# Altium schematic sheet BW1098FFC_MIPI_CAM.SchDoc: =project_title
size Tabloid; PageSetup: Record=PageOptions|CenterHorizontal=True|CenterVertical=True|PrintScale=0.73|XCorrection=1.00|YCorrection=1.00|PrintKind=0|BorderSize=5000000|LeftOffset=0|BottomOffset=0|Orientation=2|PaperLength=1000|PaperWidth=1000|Scale=100|PaperSource=7|PrintQuality=-4|MediaType=1|DitherType=10|PaperKind=A4|PrintScaleMode=1; CompanyName: Luxonis Holding; Organization: Luxonis Holding; Address1: 1925 Harmony Park Drive; Address2: Westminster, CO; Address3: 80234; Address4: United States; SheetNumber: 4; SheetTotal: 5
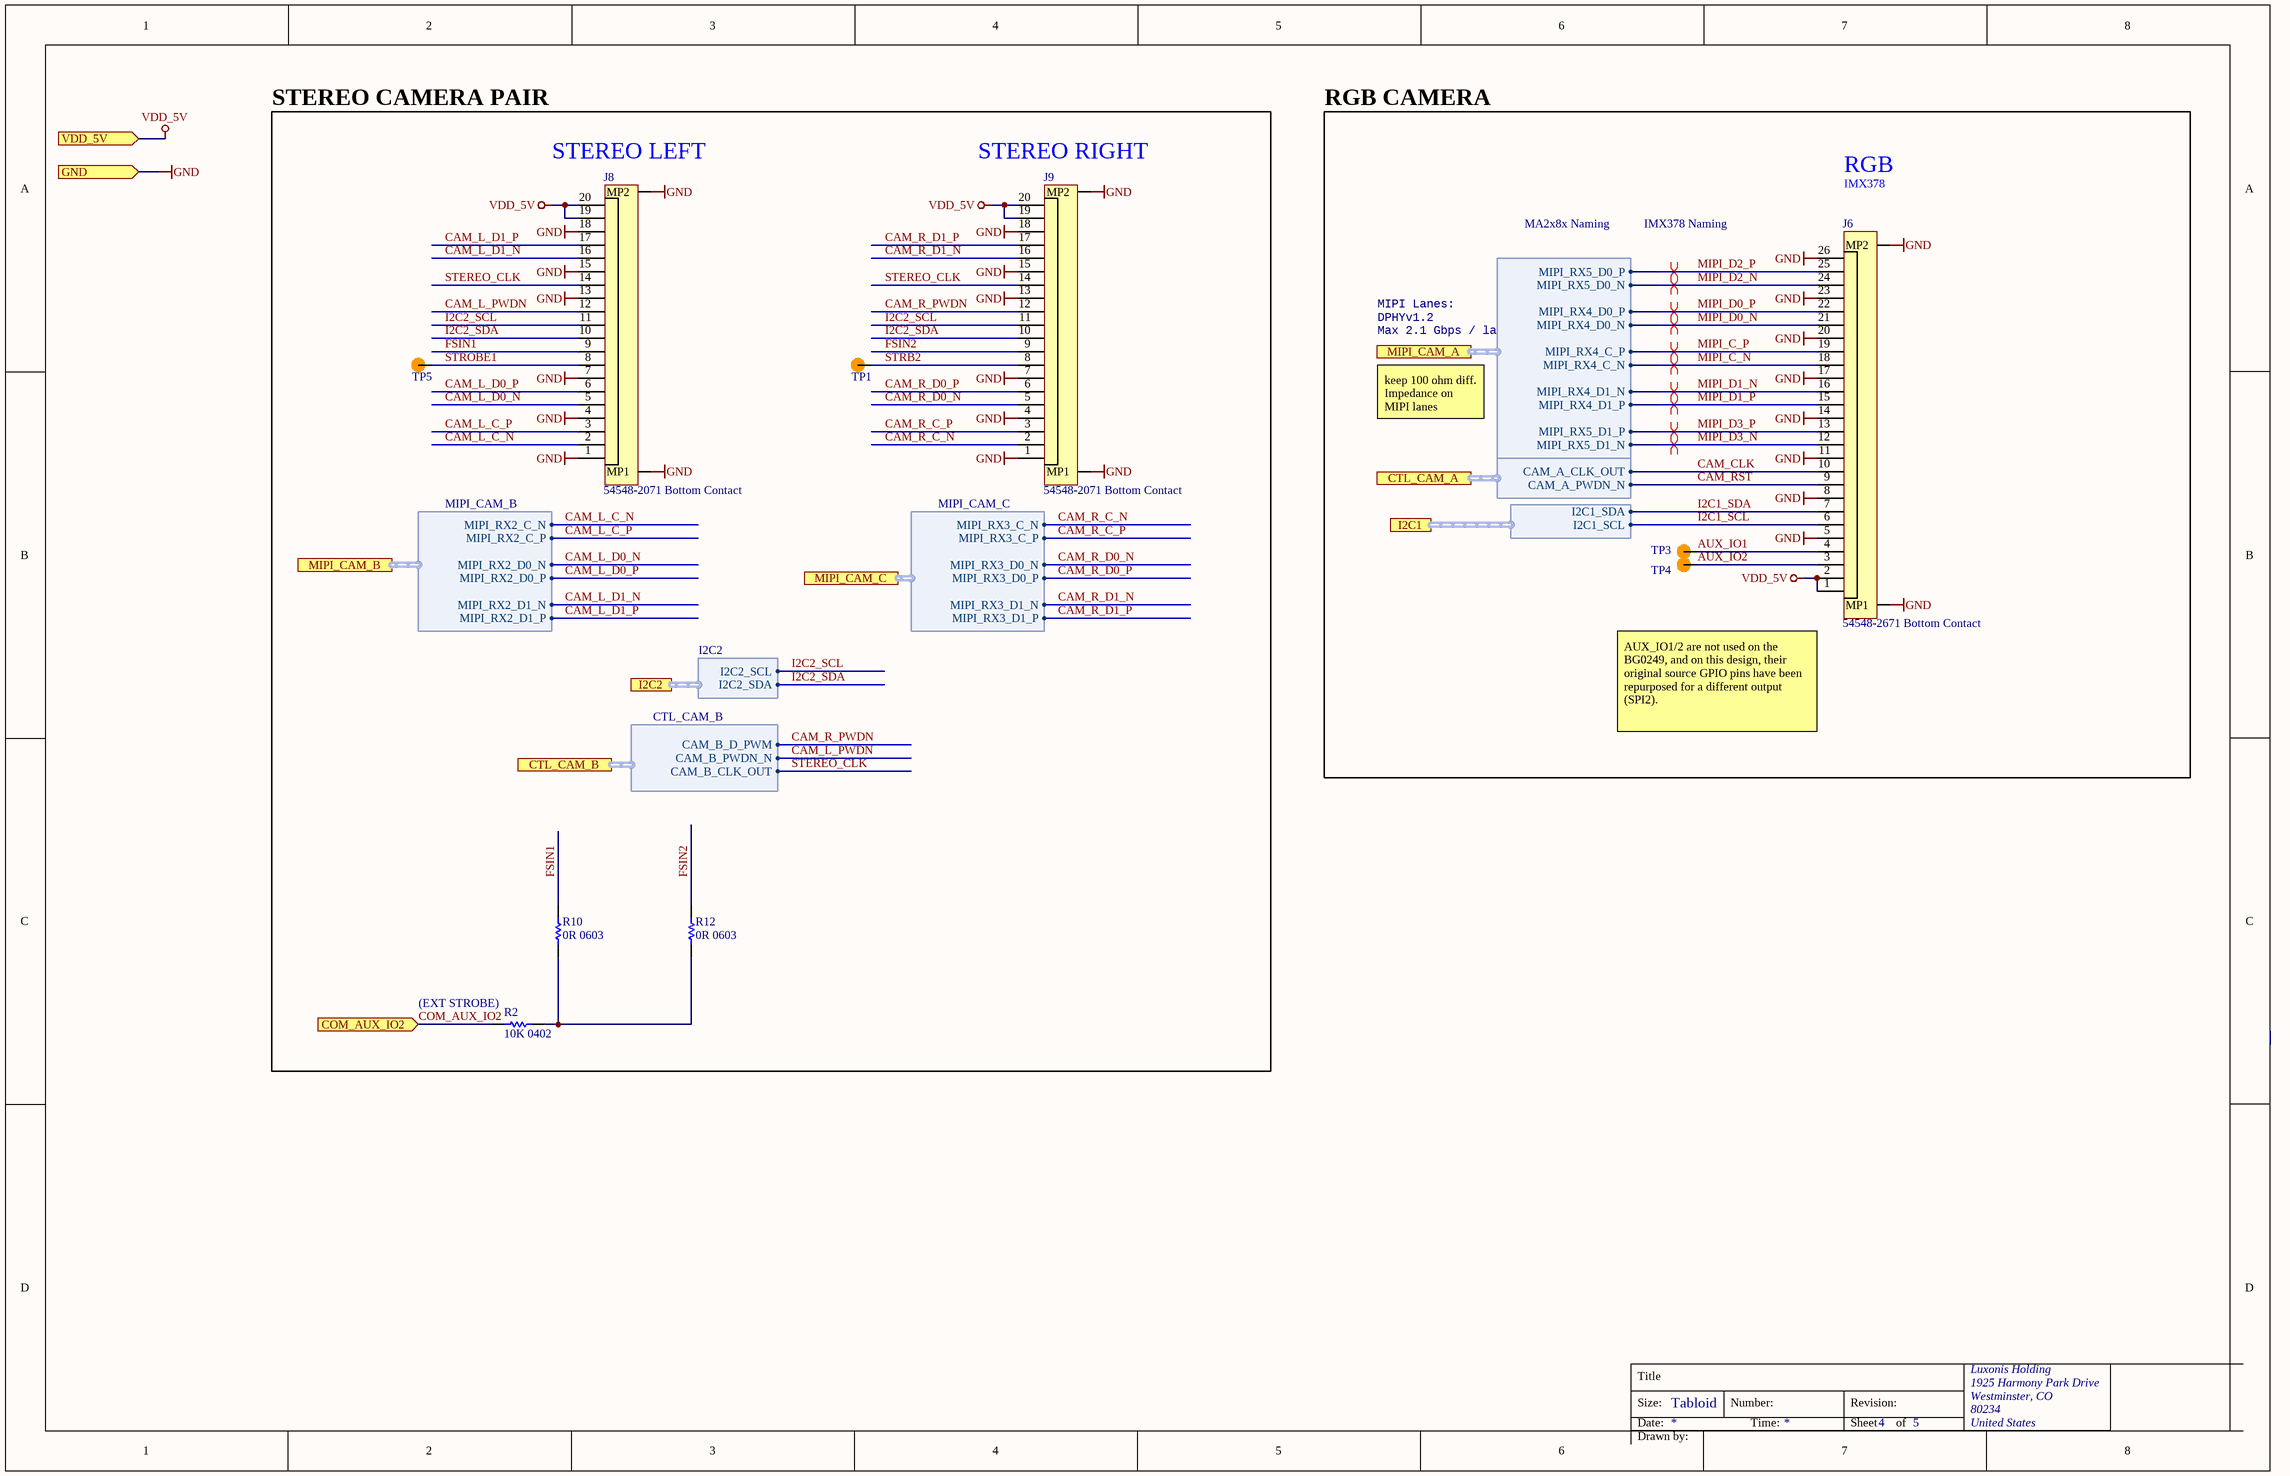
[diagram p0: BW1098FFC_MIPI_CAM.SchDoc]

## Parts
J6  54548-2671 Bottom Contact  [54548-2671]
J8  54548-2071 Bottom Contact  [54548-2071]
J9  54548-2071 Bottom Contact  [54548-2071]
R2  10K 0402  [RESC0402(1005)_N]
R10  0R 0603  [RESC0603(1608)_N]
R12  0R 0603  [RESC0603(1608)_N]
TP1  TP100_200_NS  [TP100_200_NS]  (value not drawn)  (no BOM)
TP3  TP100_200_NS  [TP100_200_NS]  (value not drawn)  (no BOM)
TP4  TP100_200_NS  [TP100_200_NS]  (value not drawn)  (no BOM)
TP5  TP100_200_NS  [TP100_200_NS]  (value not drawn)  (no BOM)

## Ports
COM_AUX_IO2 (in), CTL_CAM_A (harness CTL_CAM_A), CTL_CAM_B (harness CTL_CAM_B), GND (in), I2C1 (harness I2C1), I2C2 (harness I2C2), MIPI_CAM_A (harness MIPI_CAM_A), MIPI_CAM_B (harness MIPI_CAM_B), MIPI_CAM_C (harness MIPI_CAM_C), VDD_5V (in)

## Harnesses
MIPI_CAM_B: MIPI_RX2_C_P, MIPI_RX2_C_N, MIPI_RX2_D0_P, MIPI_RX2_D0_N, MIPI_RX2_D1_P, MIPI_RX2_D1_N
I2C2: I2C2_SDA, I2C2_SCL
I2C1: I2C1_SDA, I2C1_SCL
MIPI_CAM_A: MIPI_RX5_D0_P, MIPI_RX5_D0_N, MIPI_RX4_D0_P, MIPI_RX4_D0_N, MIPI_RX4_C_P, MIPI_RX4_C_N, MIPI_RX4_D1_N, MIPI_RX4_D1_P, MIPI_RX5_D1_P, MIPI_RX5_D1_N
MIPI_CAM_C: MIPI_RX3_C_P, MIPI_RX3_C_N, MIPI_RX3_D0_P, MIPI_RX3_D0_N, MIPI_RX3_D1_P, MIPI_RX3_D1_N
CTL_CAM_A: CAM_A_PWDN_N, CAM_A_CLK_OUT
CTL_CAM_B: CAM_B_CLK_OUT, CAM_B_PWDN_N, CAM_B_D_PWM

## Nets
GND: J6.5 J6.8 J6.11 J6.14 J6.17 J6.20 J6.23 J6.26 J6.MP1 J6.MP2 J8.1 J8.4 J8.7 J8.13 J8.15 J8.18 J8.MP1 J8.MP2 J9.1 J9.4 J9.7 J9.13 J9.15 J9.18 J9.MP1 J9.MP2 ; port GND
VDD_5V: J6.1 J6.2 J8.19 J8.20 J9.19 J9.20 ; port VDD_5V
AUX_IO1: J6.4 TP3.1
AUX_IO2: J6.3 TP4.1
CAM_CLK: J6.10 ; port CTL_CAM_A.CAM_A_CLK_OUT
CAM_L_C_N: J8.2 ; port MIPI_CAM_B.MIPI_RX2_C_N
CAM_L_C_P: J8.3 ; port MIPI_CAM_B.MIPI_RX2_C_P
CAM_L_D0_N: J8.5 ; port MIPI_CAM_B.MIPI_RX2_D0_N
CAM_L_D0_P: J8.6 ; port MIPI_CAM_B.MIPI_RX2_D0_P
CAM_L_D1_N: J8.16 ; port MIPI_CAM_B.MIPI_RX2_D1_N
CAM_L_D1_P: J8.17 ; port MIPI_CAM_B.MIPI_RX2_D1_P
CAM_L_PWDN: J8.12 ; port CTL_CAM_B.CAM_B_PWDN_N
CAM_R_C_N: J9.2 ; port MIPI_CAM_C.MIPI_RX3_C_N
CAM_R_C_P: J9.3 ; port MIPI_CAM_C.MIPI_RX3_C_P
CAM_R_D0_N: J9.5 ; port MIPI_CAM_C.MIPI_RX3_D0_N
CAM_R_D0_P: J9.6 ; port MIPI_CAM_C.MIPI_RX3_D0_P
CAM_R_D1_N: J9.16 ; port MIPI_CAM_C.MIPI_RX3_D1_N
CAM_R_D1_P: J9.17 ; port MIPI_CAM_C.MIPI_RX3_D1_P
CAM_R_PWDN: J9.12 ; port CTL_CAM_B.CAM_B_D_PWM
CAM_RST: J6.9 ; port CTL_CAM_A.CAM_A_PWDN_N
COM_AUX_IO2: R2.1 ; port COM_AUX_IO2
FSIN1: J8.9 R10.2
FSIN2: J9.9 R12.2
I2C1_SCL: J6.6 ; port I2C1.I2C1_SCL
I2C1_SDA: J6.7 ; port I2C1.I2C1_SDA
I2C2_SCL: J8.11 J9.11 ; port I2C2.I2C2_SCL
I2C2_SDA: J8.10 J9.10 ; port I2C2.I2C2_SDA
MIPI_C_N: J6.18 ; port MIPI_CAM_A.MIPI_RX4_C_N
MIPI_C_P: J6.19 ; port MIPI_CAM_A.MIPI_RX4_C_P
MIPI_D0_N: J6.21 ; port MIPI_CAM_A.MIPI_RX4_D0_N
MIPI_D0_P: J6.22 ; port MIPI_CAM_A.MIPI_RX4_D0_P
MIPI_D1_N: J6.16 ; port MIPI_CAM_A.MIPI_RX4_D1_N
MIPI_D1_P: J6.15 ; port MIPI_CAM_A.MIPI_RX4_D1_P
MIPI_D2_N: J6.24 ; port MIPI_CAM_A.MIPI_RX5_D0_N
MIPI_D2_P: J6.25 ; port MIPI_CAM_A.MIPI_RX5_D0_P
MIPI_D3_N: J6.12 ; port MIPI_CAM_A.MIPI_RX5_D1_N
MIPI_D3_P: J6.13 ; port MIPI_CAM_A.MIPI_RX5_D1_P
STEREO_CLK: J8.14 J9.14 ; port CTL_CAM_B.CAM_B_CLK_OUT
STRB2: J9.8 TP1.1
STROBE1: J8.8 TP5.1
NetR2_2: R2.2 R10.1 R12.1

## Layout directives
differential pair: MIPI_C_N, MIPI_C_P, MIPI_D0_N, MIPI_D0_P, MIPI_D1_N, MIPI_D1_P, MIPI_D2_N, MIPI_D2_P, MIPI_D3_N, MIPI_D3_P

## Notes on the sheet
- STEREO CAMERA PAIR
- (near J8) STEREO LEFT
- (near J9) STEREO RIGHT
- RGB CAMERA
- MA2x8x Naming
- IMX378 Naming
- RGB
- IMX378
- MIPI Lanes:
- Max 2.1 Gbps / lane
- DPHYv1.2
- keep 100 ohm diff. Impedance on MIPI lanes
- (near J6) AUX_IO1/2 are not used on the BG0249, and on this design, their original source GPIO pins have been repurposed for a different output (SPI2).
- (near R2) (EXT STROBE)
- Title
- Size:
- Date:
- Tabloid
- Number:
- Time:
- Revision:
- Sheet
- of
- Drawn by:

## Library data of the parts
J6 = 54548-2671: CONN FFC BOTTOM 26POS 0.50MM R/A 26 Position FFC, FPC Connector Contacts, Bottom 0.020" (0.50mm) Surface Mount, Right Angle; Manufacturer_Name: Molex; Actuator Material: Polyphenylene; Current Rating: 500mA; Voltage Rating: 50V; Contact Resistance: 40mR; Number of Positions: 26; Wire/Cable Type: Straight; Pitch: 0.5mm; Datasheet Link: https://www.molex.com/molex/products/datasheet.jsp?part=active/0545482671_FFC_FPC_CONNECTORS.xml&channel=Products&Lang=en-US; Height: 1mm; Manufacturer_Part_Number: 54548-2671; Mouser Part Number: 538-54548-2671; Mouser Price/Stock: https://eu.mouser.com/ProductDetail/Molex/54548-2671?qs=sGAEpiMZZMs7i6cT6ogu49DbkzKdWzYdwOJCTNigfgU%3D; RoHS: Yes; Mount: Surface Mount; Contact Material: Bronze; Contact Plating: Gold; Housing Material: Polymer; Housing Color: Black; Min Operating Temperature: -20°C; Max Operating Temperature: 85°C; Number of Rows: 1; Package Quantity: 750; Packaging: Tape and Reel; Termination: Solder; Number of Contacts: 26; Orientation: Right Angle; Length: 18.2mm; Depth: 5mm; Flammability Rating: UL94 V-0; ComponentLink1URL: https://datasheet.ciiva.com/5137/0545482671-ffc-fpc-connectors-146697-5137857.pdf?src-supplier=Mouser; ComponentLink1Description: https://datasheet.ciiva.com/5137/0545482671-ffc-fpc-connectors-146697-5137857.pdf?src-supplier=Mouser; Supplier 1: Mouser; Manufacturer 1: Molex; Manufacturer Part Number 1: 54548-2671; Stock 1: 6344; Pricing 1: 1=3.03000, 10=2.86000, 25=2.55000, 100=2.42000, 250=2.12000, 500=2.07000 (USD); Supplier 2: Arrow; Manufacturer 2: Molex; Manufacturer Part Number 2: 54548-2671; Stock 2: 11173; Pricing 2: 1=3.50200, 10=3.34800, 25=3.06600, 100=2.78390, 250=2.43800, 500=2.41400, 1000=2.25990, 3000=2.10600, 6000=1.95200, 12000=1.73300, 24000=1.71600, 48000=1.69900, 60000=1.68200 (USD); Supplier Part Number 2: 0545482671; Supplier Part Number 1: 538-54548-2671
J8 J9 = 54548-2071: CONN FFC BOTTOM 20POS 0.50MM R/A 20 Position FFC, FPC Connector Contacts, Bottom 0.020" (0.50mm) Surface Mount, Right Angle; Manufacturer_Name: Molex; Actuator Material: Polyphenylene; Current Rating: 500mA; Voltage Rating: 50V; Contact Resistance: 40mR; Number of Positions: 20; Wire/Cable Type: Straight; Pitch: 0.02inch; Datasheet Link: http://www.molex.com/webdocs/datasheets/pdf/en-us//0545482271_FFC_FPC_CONNECTORS.pdf; Height: 1mm; Manufacturer_Part_Number: 54548-2071; Mouser Part Number: 538-54548-2071; Mouser Price/Stock: https://www.mouser.com/Search/Refine.aspx?Keyword=538-54548-2071; Supplier 1: Digi-Key; Manufacturer 1: Molex; Manufacturer Part Number 1: 54548-2071; Stock 1: 15609; Pricing 1: 1=2.57000, 10=2.33100, 25=2.18840, 50=2.09340, 100=1.99820, 250=1.80784 (USD); RoHS: Yes; Mount: Surface Mount; Contact Material: Bronze; Contact Plating: Gold; Housing Color: Black; Housing Material: Polymer; Min Operating Temperature: -20°C; Max Operating Temperature: 85°C; Number of Rows: 1; Termination: Solder; Orientation: Right Angle; Package Quantity: 750; Packaging: Tape and Reel; Mating Cycles: 20; Length: 15.2mm; Depth: 5mm; Radiation Hardening: No; Flammability Rating: UL94 V-0; ComponentLink1URL: https://datasheet.ciiva.com/15244/30580545482071-ffc-fpc-nectors-15244814.pdf?src-supplier=Arrow+Europe; ComponentLink1Description: https://datasheet.ciiva.com/15244/30580545482071-ffc-fpc-nectors-15244814.pdf?src-supplier=Arrow+Europe; Supplier 2: Mouser; Manufacturer 2: Molex; Manufacturer Part Number 2: 54548-2071; Stock 2: 4396; Pricing 2: 1=2.16000, 10=1.90000, 100=1.73000, 250=1.51000, 500=1.47000, 1000=1.25000, 3000=1.16000, 6000=1.12000 (USD); Supplier Part Number 1: WM8829CT-ND; Supplier Part Number 2: 538-54548-2071
R2 = RC0402FR-1310KL: RES SMD 10K OHM 1% 0402 1/16W Chip Resistor, 0402 [1005 Metric], 10 kohm, RC Series, 50 V, Thick Film, 62.5 mW; Manufacturer 1: Yageo; Resistance: 10kR; Temperature Coefficient: 100ppm/°C; Power Rating: 62.5mW; Voltage Rating: 50V; ComponentLink1URL: https://datasheet.ciiva.com/16940/pyu-rc0402-51-rohs-l-6-16940293.pdf?src-supplier=Avnet+Europe; ComponentLink1Description: https://datasheet.ciiva.com/16940/pyu-rc0402-51-rohs-l-6-16940293.pdf?src-supplier=Avnet+Europe; ComponentLink2URL: https://datasheet.ciiva.com/28386/pyu-rc0402-51-rohs-l-6-28386855.pdf?src-supplier=Avnet+Europe; ComponentLink2Description: https://datasheet.ciiva.com/28386/pyu-rc0402-51-rohs-l-6-28386855.pdf?src-supplier=Avnet+Europe; ComponentLink3URL: https://datasheet.ciiva.com/16740/pyu-rc0402-51-rohs-l-6-r-16740602.pdf?src-supplier=Future+Electronics; ComponentLink3Description: https://datasheet.ciiva.com/16740/pyu-rc0402-51-rohs-l-6-r-16740602.pdf?src-supplier=Future+Electronics; ComponentLink4URL: https://datasheet.ciiva.com/8891/pyu-rc0402-51-rohs-l-6-8891339.pdf?src-supplier=Avnet; ComponentLink4Description: https://datasheet.ciiva.com/8891/pyu-rc0402-51-rohs-l-6-8891339.pdf?src-supplier=Avnet; ComponentLink5URL: https://datasheet.ciiva.com/5557/pyu-rc0402-51-rohs-l-6-r-5557997.pdf?src-supplier=Mouser; ComponentLink5Description: https://datasheet.ciiva.com/5557/pyu-rc0402-51-rohs-l-6-r-5557997.pdf?src-supplier=Mouser; ComponentLink6URL: https://datasheet.ciiva.com/7983/1018594-7983533.pdf?src-supplier=Element14; ComponentLink6Description: https://datasheet.ciiva.com/7983/1018594-7983533.pdf?src-supplier=Element14; Supplier 1: Newark; Manufacturer Part Number 1: RC0402FR-1310KL; Stock 1: 62239; Pricing 1: 1=0.10000, 25=0.01200, 100=0.00400, 250=0.00400, 500=0.00300, 1000=0.00300 (USD); RoHS: Yes; Case/Package: 0402; Number of Pins: 2; Contact Plating: Tin,Matte,Lead; Case Code (Imperial): 0402; Case Code (Metric): 1005; Min Operating Temperature: -55°C; Max Operating Temperature: 155°C; Tolerance: 1%; Composition: Thick Film; Packaging: Tape and Reel; Termination: SMD/SMT; Military Standard: Not; Voltage Rating (DC): 50V; Working Voltage: 50V; Number of Terminations: 2; Length: 1mm; Depth: 0.5mm; Radiation Hardening: No; REACH SVHC: No SVHC; Lead Free: Lead Free; Supplier Part Number 1: 67R9960
R10 R12 = CRCW06030000Z0EA: RES SMD 0 OHM JUMPER 1/10W 0603 0 Ohms Jumper 0.1W, 1/10W Chip Resistor 0603 (1608 Metric) Automotive AEC-Q200 Thick Film; Manufacturer 1: Vishay; Manufacturer Part Number 1: CRCW0603-0000Z0EA; Resistance: 0mR; Power Rating: 100mW; Voltage Rating: 75V; Temperature Coefficient: 100ppm/°C; Tolerance: 5%; Current Rating: 2A; Supplier 1: Digi-Key; Stock 1: 742743; Pricing 1: 1=0.100000, 10=0.034000, 25=0.024400, 50=0.018600, 100=0.013800, 250=0.010480, 500=0.008400, 1000=0.006180 (USD); RoHS: Yes; Mount: Surface Mount; Case/Package: 0603; Weight: 7.1E-05oz; Contact Plating: Tin,Lead; Case Code (Metric): 1608; Case Code (Imperial): 0603; Min Operating Temperature: -55°C; Max Operating Temperature: 155°C; Composition: Thick Film; Termination: SMD/SMT; Packaging: Tape and Reel; Package Quantity: 1; Number of Terminations: 2; Military Standard: Not; Max Power Dissipation: 100mW; Voltage Rating (DC): 75V; Features: Automotive AEC-Q200; Working Voltage: 75V; Length: 1.55mm; Height: 0.02inch; Width: 0.033inch; Depth: 0.85mm; Radiation Hardening: No; Lead Free: Lead Free; REACH SVHC: Unknown; ComponentLink1URL: https://datasheet.ciiva.com/2461/dcrcwe3-2461968.pdf?src-supplier=Digi-Key; ComponentLink1Description: https://datasheet.ciiva.com/2461/dcrcwe3-2461968.pdf?src-supplier=Digi-Key; ComponentLink2URL: https://datasheet.ciiva.com/2461/dcrcwe3-2461969.pdf?src-supplier=Digi-Key; ComponentLink2Description: https://datasheet.ciiva.com/2461/dcrcwe3-2461969.pdf?src-supplier=Digi-Key; ComponentLink3URL: https://datasheet.ciiva.com/2461/dcrcwe3-2461970.pdf?src-supplier=Digi-Key; ComponentLink3Description: https://datasheet.ciiva.com/2461/dcrcwe3-2461970.pdf?src-supplier=Digi-Key; ComponentLink4URL: https://datasheet.ciiva.com/8340/dcrcwe3-8340197.pdf?src-supplier=Avnet; ComponentLink4Description: https://datasheet.ciiva.com/8340/dcrcwe3-8340197.pdf?src-supplier=Avnet; ComponentLink5URL: https://datasheet.ciiva.com/16941/dcrcw-16941302.pdf?src-supplier=Avnet+Europe; ComponentLink5Description: https://datasheet.ciiva.com/16941/dcrcw-16941302.pdf?src-supplier=Avnet+Europe; ComponentLink6URL: https://datasheet.ciiva.com/16199/dcrcwe3-16199063.pdf?src-supplier=Future+Electronics; ComponentLink6Description: https://datasheet.ciiva.com/16199/dcrcwe3-16199063.pdf?src-supplier=Future+Electronics; ComponentLink7URL: https://datasheet.ciiva.com/16725/70201119-16725175.pdf?src-supplier=Allied+Electronics; ComponentLink7Description: https://datasheet.ciiva.com/16725/70201119-16725175.pdf?src-supplier=Allied+Electronics; ComponentLink8URL: https://datasheet.ciiva.com/26316/fld-crcw-e3-data-en-26316615.pdf?src-supplier=Distrelec; ComponentLink8Description: https://datasheet.ciiva.com/26316/fld-crcw-e3-data-en-26316615.pdf?src-supplier=Distrelec; ComponentLink9URL: https://datasheet.ciiva.com/5544/dcrcwe3-109170-5544344.pdf?src-supplier=Mouser; ComponentLink9Description: https://datasheet.ciiva.com/5544/dcrcwe3-109170-5544344.pdf?src-supplier=Mouser; ComponentLink10URL: https://datasheet.ciiva.com/7841/1720486-7841816.pdf?src-supplier=Element14; ComponentLink10Description: https://datasheet.ciiva.com/7841/1720486-7841816.pdf?src-supplier=Element14; ComponentLink11URL: https://datasheet.ciiva.com/7841/1720486-7841817.pdf?src-supplier=Element14; ComponentLink11Description: https://datasheet.ciiva.com/7841/1720486-7841817.pdf?src-supplier=Element14; ComponentLink12URL: https://datasheet.ciiva.com/7841/125364-7841818.pdf?src-supplier=Element14; ComponentLink12Description: https://datasheet.ciiva.com/7841/125364-7841818.pdf?src-supplier=Element14; ComponentLink13URL: https://datasheet.ciiva.com/16721/70201119-16721450.pdf?src-supplier=Allied+Electronics; ComponentLink13Description: https://datasheet.ciiva.com/16721/70201119-16721450.pdf?src-supplier=Allied+Electronics; Supplier Part Number 1: 541-0.0GCT-ND
TP1 TP3-TP5 = TEST_POINT